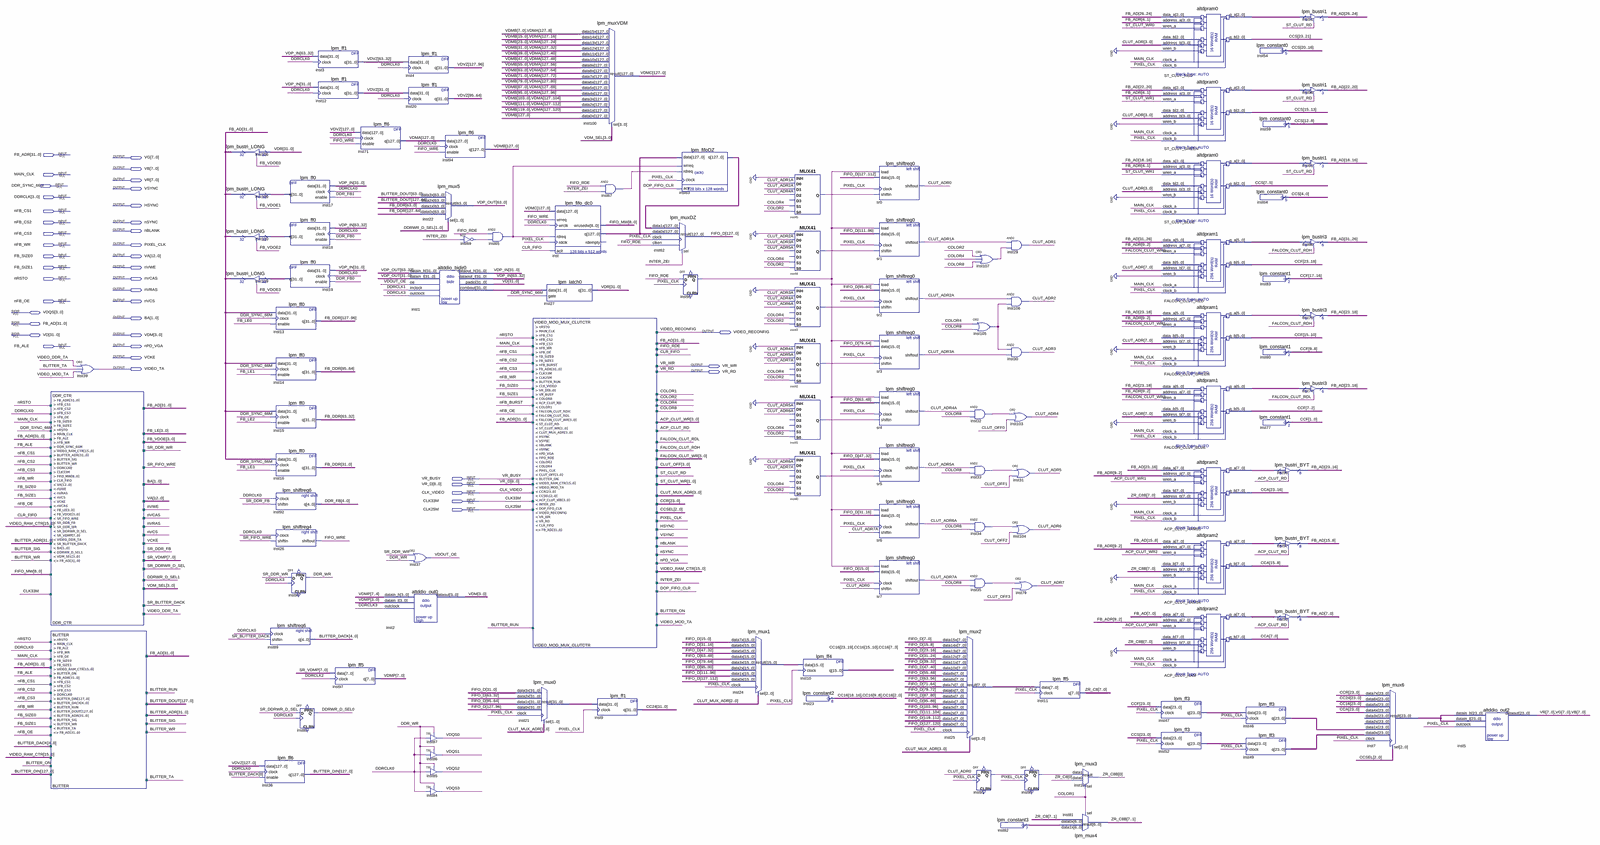
[diagram p0: schematic sheet, whole]
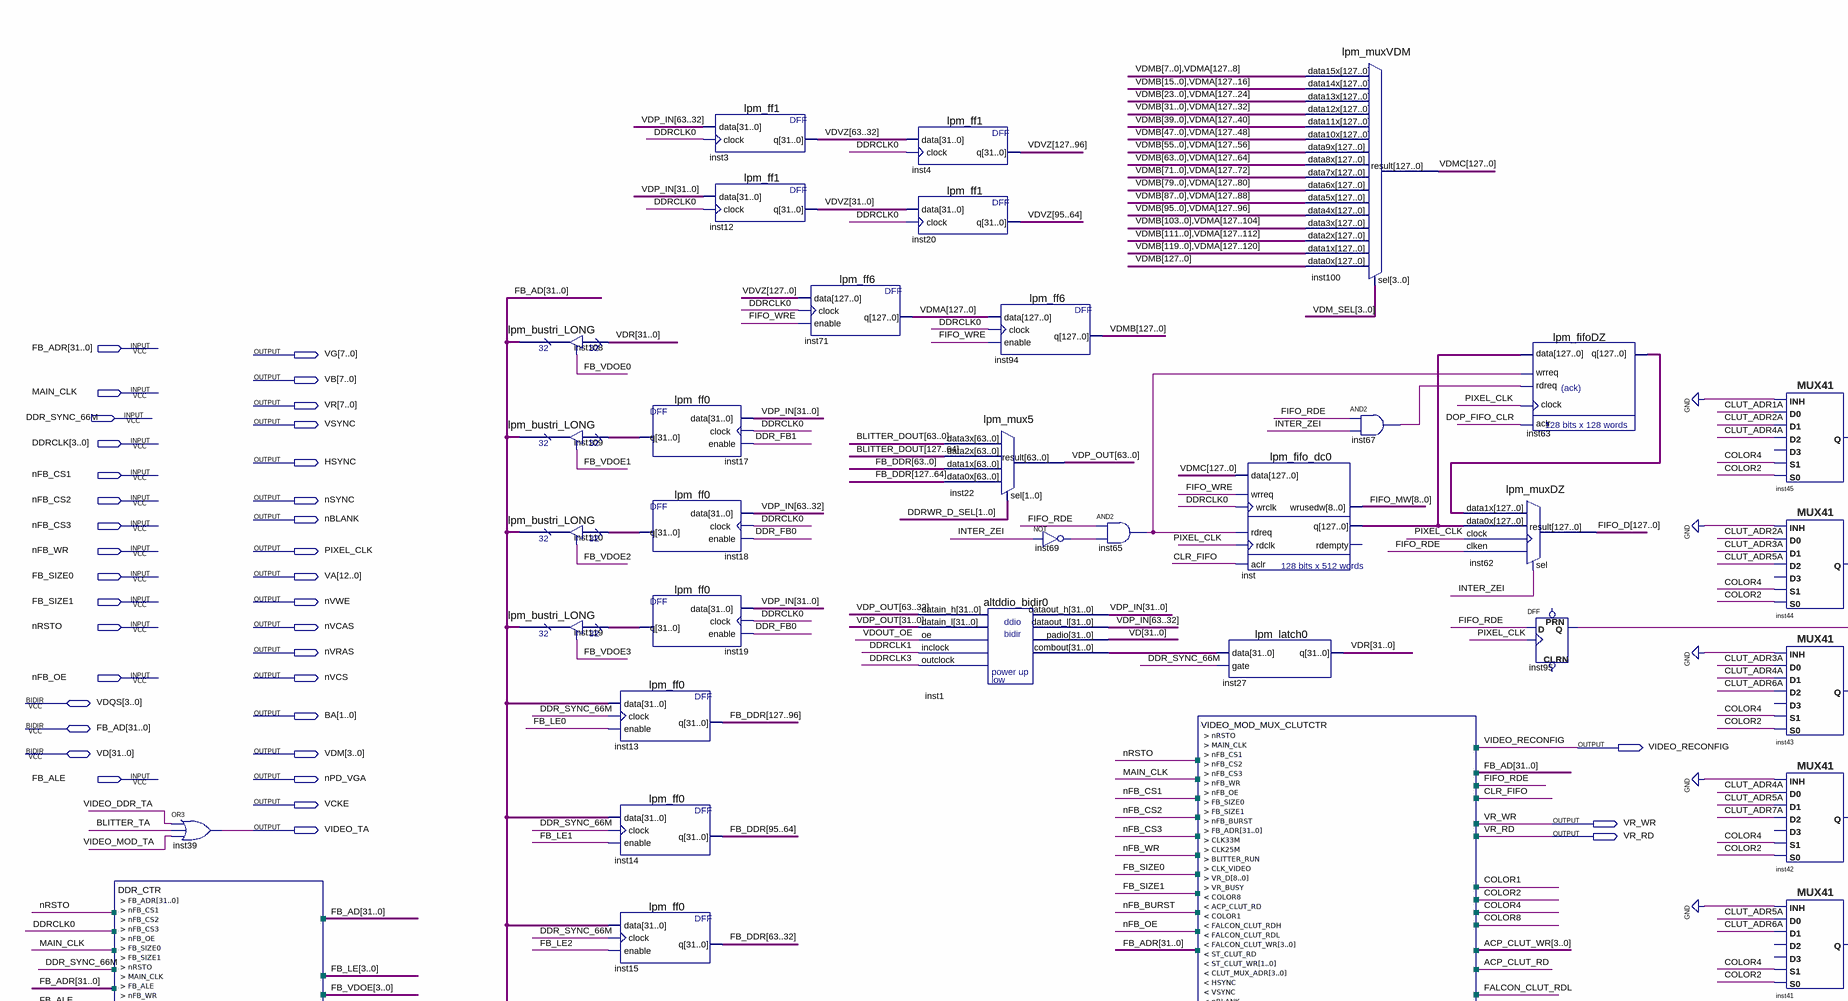
[diagram p1: schematic sheet, upper left part]
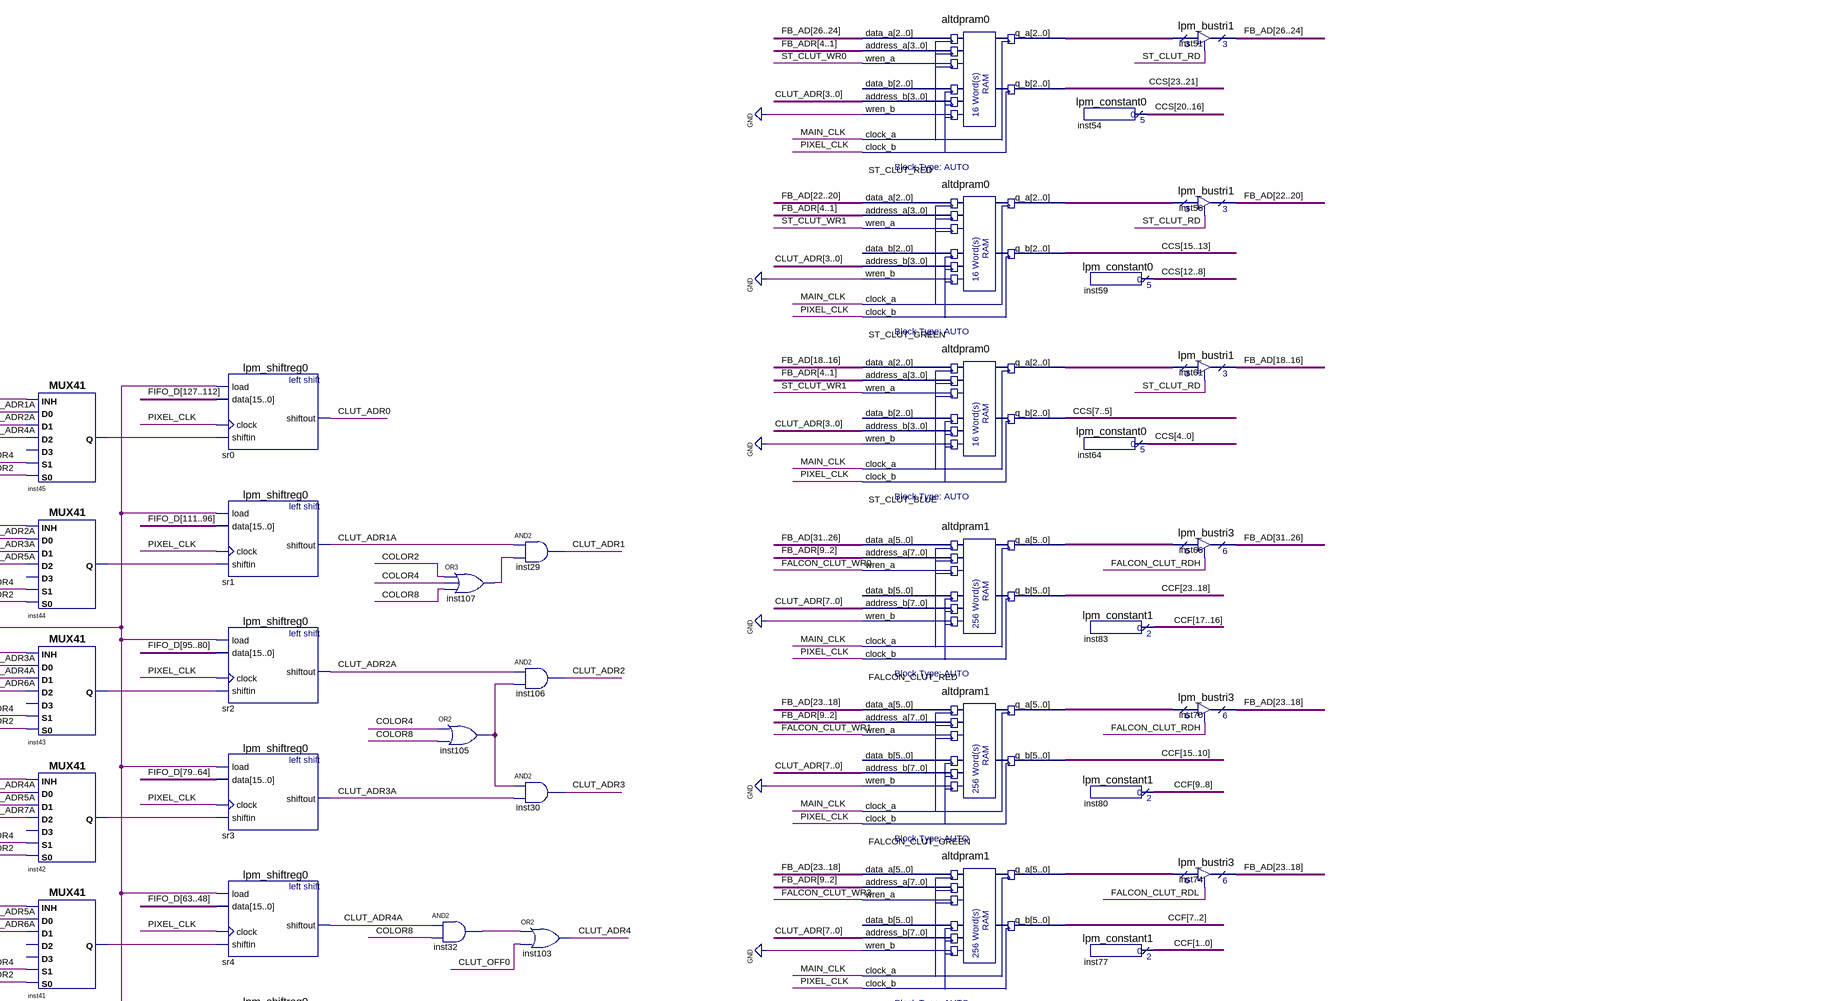
[diagram p2: schematic sheet, upper right part]
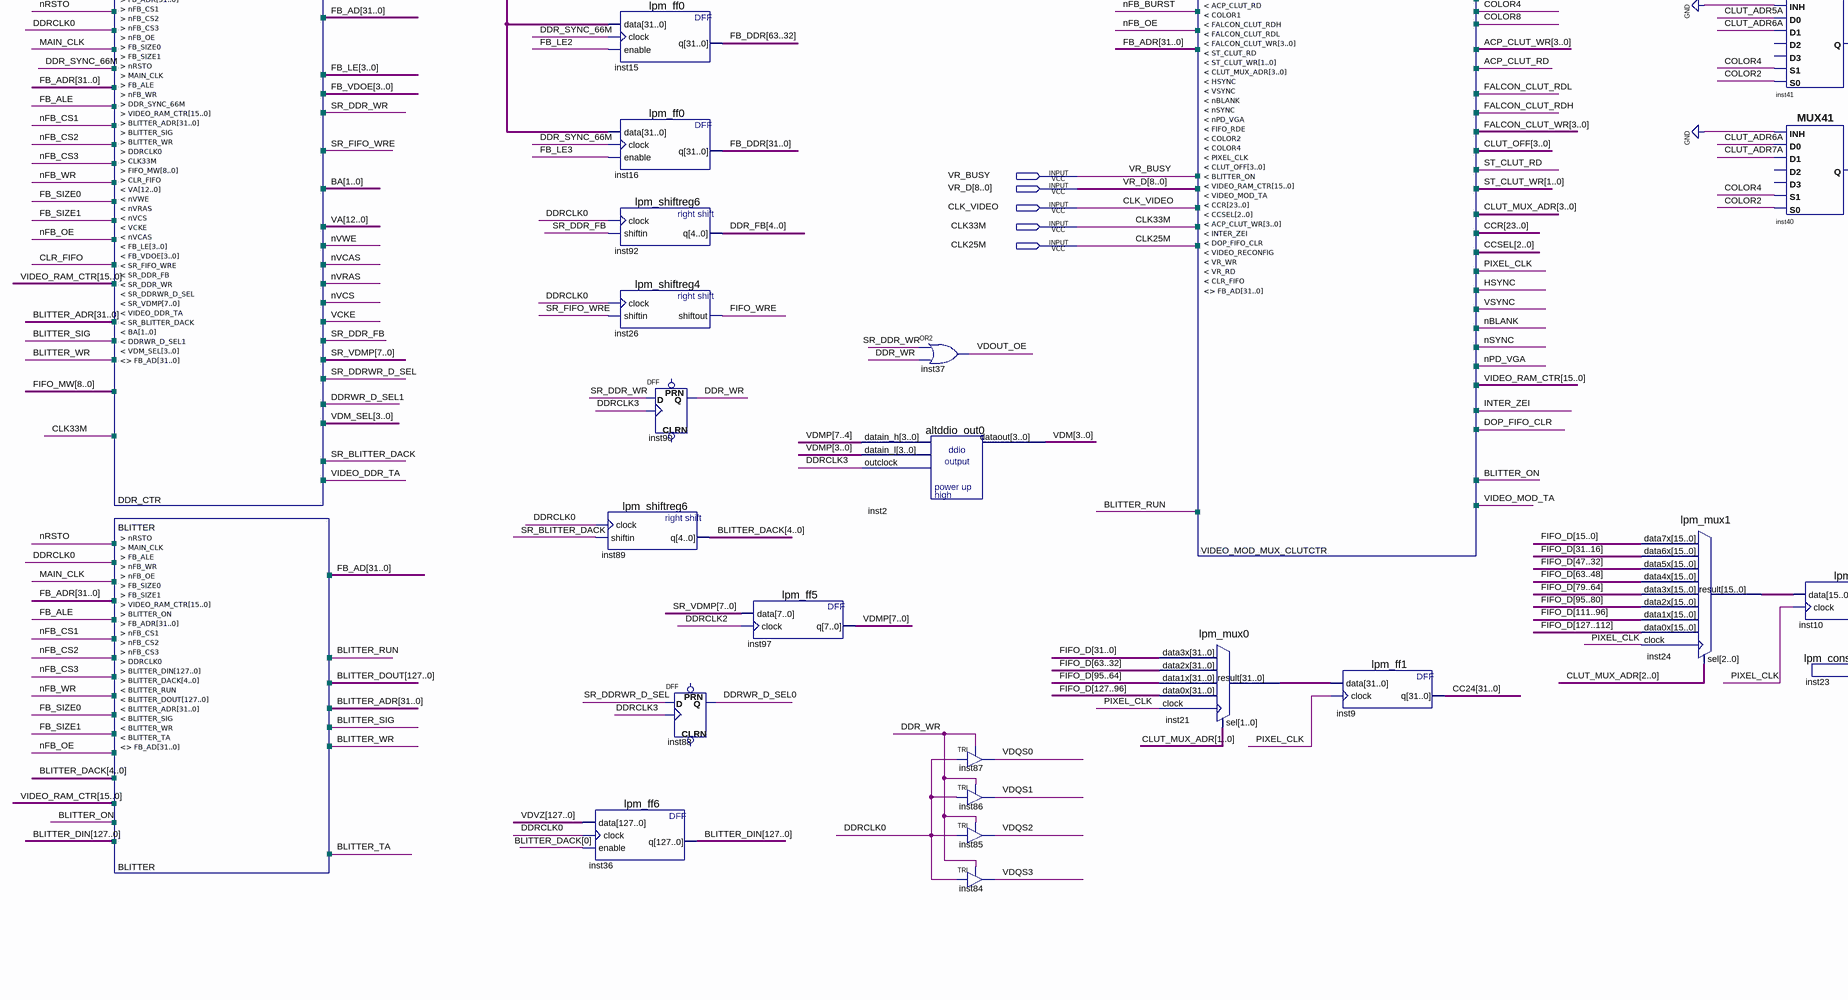
[diagram p3: schematic sheet, lower left part]
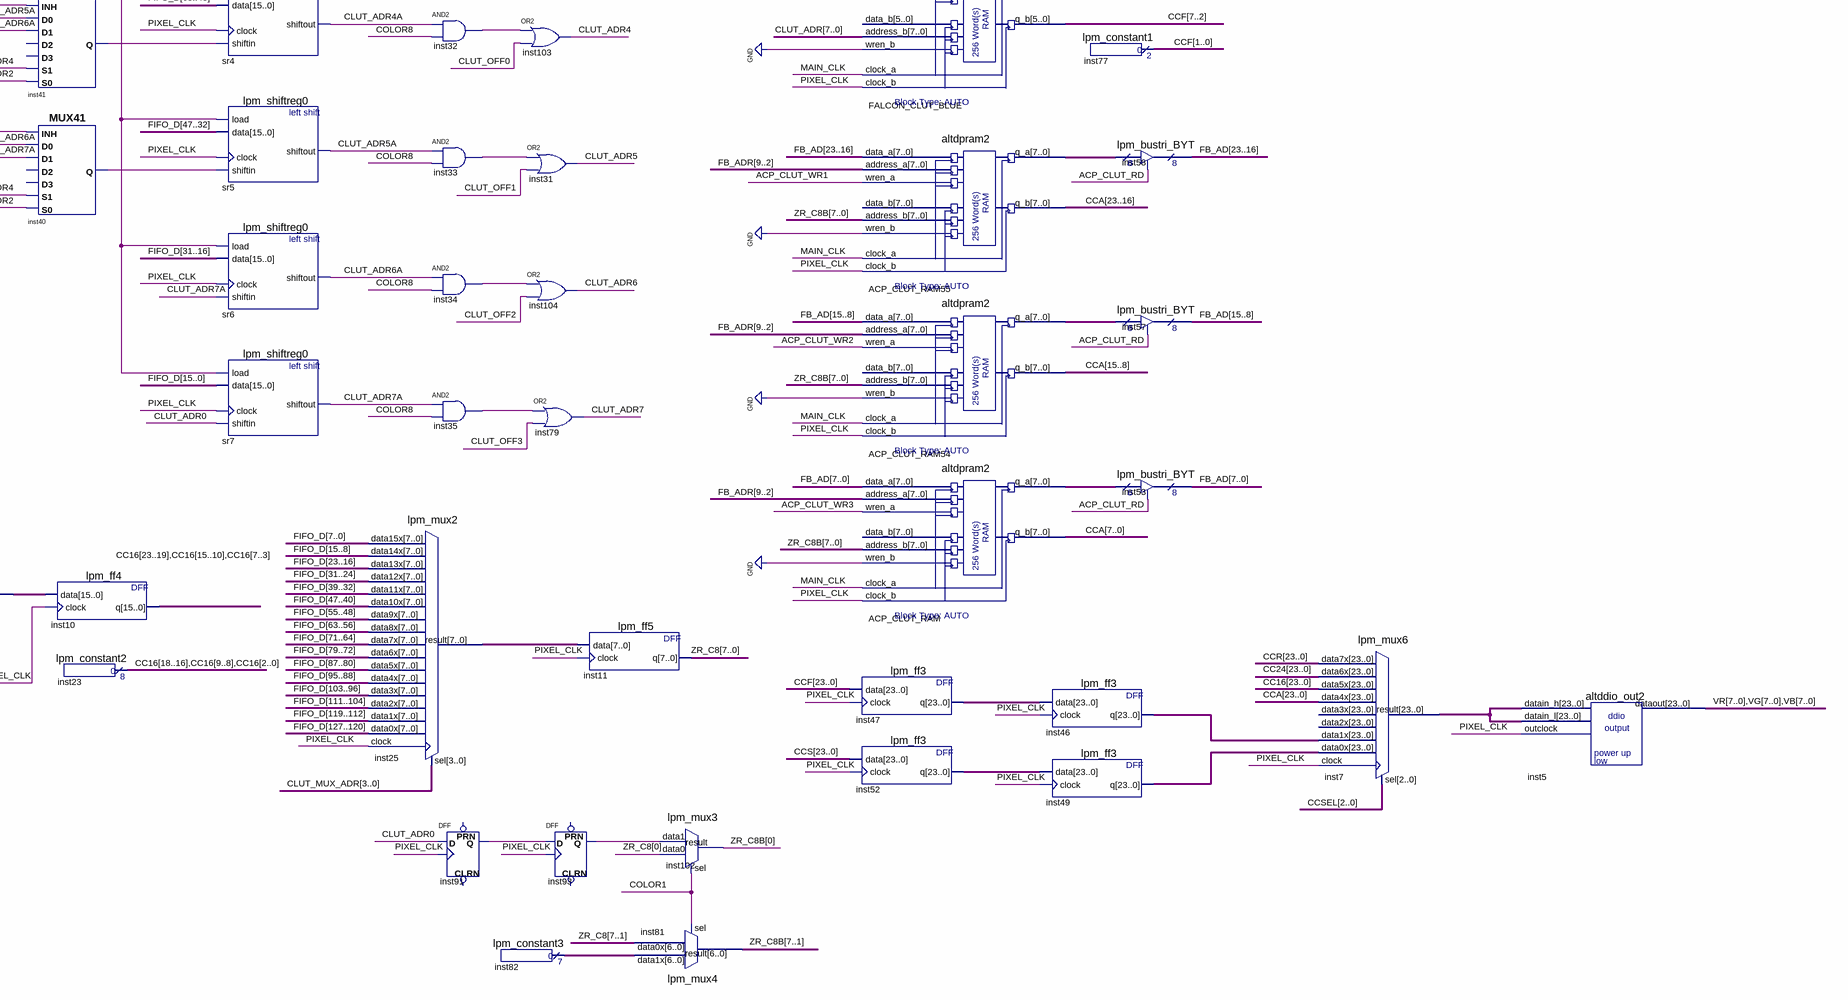
[diagram p4: schematic sheet, lower right part]
// Quartus schematic Video.bdf as structural Verilog: 114 symbols, 42 pins
module Video (
  input  [31:0] FB_ADR,
  input  MAIN_CLK,
  input  DDR_SYNC_66M,
  input  [3:0] DDRCLK,
  input  nFB_CS1,
  input  nFB_CS2,
  input  nFB_CS3,
  input  nFB_WR,
  input  FB_SIZE0,
  input  FB_SIZE1,
  input  nRSTO,
  input  nFB_OE,
  input  FB_ALE,
  input  VR_BUSY,
  input  [8:0] VR_D,
  input  CLK_VIDEO,
  input  CLK33M,
  input  CLK25M,
  inout  [3:0] VDQS,
  inout  [31:0] FB_AD,
  inout  [31:0] VD,
  output [7:0] VG,
  output [7:0] VB,
  output [7:0] VR,
  output VSYNC,
  output HSYNC,
  output nSYNC,
  output nBLANK,
  output PIXEL_CLK,
  output [12:0] VA,
  output nVWE,
  output nVCAS,
  output nVRAS,
  output nVCS,
  output [1:0] BA,
  output VIDEO_RECONFIG,
  output [3:0] VDM,
  output nPD_VGA,
  output VCKE,
  output VR_WR,
  output VIDEO_TA,
  output VR_RD
);

  wire ACP_CLUT_RD, BLITTER_ON, BLITTER_RUN, BLITTER_SIG, BLITTER_TA, BLITTER_WR, CLR_FIFO, CLUT_ADR1A,
       CLUT_ADR2A, CLUT_ADR3A, CLUT_ADR4A, CLUT_ADR5A, CLUT_ADR6A, CLUT_ADR7A, COLOR1, COLOR2, COLOR4,
       COLOR8, DDR_WR, DOP_FIFO_CLR, FALCON_CLUT_RDH, FALCON_CLUT_RDL, FIFO_RDE, FIFO_WRE, inst32_out,
       inst33_out, inst34_out, inst35_out, inst40_q, inst41_q, inst42_q, inst43_q, inst44_q, inst45_q,
       inst65_out, inst67_out, inst69_out, inst91_q, inst93_q, inst95_q, inst105_out, inst107_out, INTER_ZEI,
       nFB_BURST, SR_BLITTER_DACK, SR_DDR_FB, SR_DDR_WR, SR_DDRWR_D_SEL, SR_FIFO_WRE, ST_CLUT_RD, VDOUT_OE,
       VIDEO_DDR_TA, VIDEO_MOD_TA;
  wire [1:0] DDRWR_D_SEL, ST_CLUT_WR;
  wire [2:0] CCSEL, ST_CLUT_BLUE_q_a, ST_CLUT_GREEN_q_a, ST_CLUT_RED_q_a;
  wire [3:0] ACP_CLUT_WR, CLUT_MUX_ADR, CLUT_OFF, FALCON_CLUT_WR, FB_LE, FB_VDOE, VDM_SEL;
  wire [4:0] BLITTER_DACK, DDR_FB;
  wire [5:0] FALCON_CLUT_BLUE_q_a, FALCON_CLUT_GREEN_q_a, FALCON_CLUT_RED_q_a;
  wire [6:0] inst82_result;
  wire [7:0] ACP_CLUT_RAM54_q_a, ACP_CLUT_RAM55_q_a, ACP_CLUT_RAM_q_a, CLUT_ADR, inst25_result, SR_VDMP,
       VDMP, ZR_C8, ZR_C8B;
  wire [8:0] FIFO_MW;
  wire [15:0] inst24_result, VIDEO_RAM_CTR;
  wire [23:0] CC16, CCA, CCF, CCR, CCS, inst7_result, inst46_q, inst47_q, inst49_q, inst52_q;
  wire [31:0] BLITTER_ADR, CC24, inst1_combout, inst17_q, inst18_q, inst19_q, inst21_result, VDR;
  wire [63:0] VDP_IN, VDP_OUT;
  wire [127:0] BLITTER_DIN, BLITTER_DOUT, FB_DDR, FIFO_D, inst63_q, inst_q, VDMA, VDMB, VDMC, VDVZ;

  DDR_CTR DDR_CTR (
    .FB_ADR(FB_ADR), .nFB_CS1(nFB_CS1), .nFB_CS2(nFB_CS2), .nFB_CS3(nFB_CS3), .nFB_OE(nFB_OE),
    .FB_SIZE0(FB_SIZE0), .FB_SIZE1(FB_SIZE1), .nRSTO(nRSTO), .MAIN_CLK(MAIN_CLK), .FB_ALE(FB_ALE),
    .nFB_WR(nFB_WR), .DDR_SYNC_66M(DDR_SYNC_66M), .VIDEO_RAM_CTR(VIDEO_RAM_CTR), .BLITTER_ADR(BLITTER_ADR),
    .BLITTER_SIG(BLITTER_SIG), .BLITTER_WR(BLITTER_WR), .DDRCLK0(DDRCLK[0]), .CLK33M(CLK33M),
    .FIFO_MW(FIFO_MW), .CLR_FIFO(CLR_FIFO), .VA(VA), .nVWE(nVWE), .nVRAS(nVRAS), .nVCS(nVCS), .VCKE(VCKE),
    .nVCAS(nVCAS), .FB_LE(FB_LE), .FB_VDOE(FB_VDOE), .SR_FIFO_WRE(SR_FIFO_WRE), .SR_DDR_FB(SR_DDR_FB),
    .SR_DDR_WR(SR_DDR_WR), .SR_DDRWR_D_SEL(SR_DDRWR_D_SEL), .SR_VDMP(SR_VDMP), .VIDEO_DDR_TA(VIDEO_DDR_TA),
    .SR_BLITTER_DACK(SR_BLITTER_DACK), .BA(BA), .DDRWR_D_SEL1(DDRWR_D_SEL[1]), .VDM_SEL(VDM_SEL),
    .FB_AD(FB_AD));
  BLITTER BLITTER (
    .nRSTO(nRSTO), .MAIN_CLK(MAIN_CLK), .FB_ALE(FB_ALE), .nFB_WR(nFB_WR), .nFB_OE(nFB_OE),
    .FB_SIZE0(FB_SIZE0), .FB_SIZE1(FB_SIZE1), .VIDEO_RAM_CTR(VIDEO_RAM_CTR), .BLITTER_ON(BLITTER_ON),
    .FB_ADR(FB_ADR), .nFB_CS1(nFB_CS1), .nFB_CS2(nFB_CS2), .nFB_CS3(nFB_CS3), .DDRCLK0(DDRCLK[0]),
    .BLITTER_DIN(BLITTER_DIN), .BLITTER_DACK(BLITTER_DACK), .BLITTER_RUN(BLITTER_RUN),
    .BLITTER_DOUT(BLITTER_DOUT), .BLITTER_ADR(BLITTER_ADR), .BLITTER_SIG(BLITTER_SIG),
    .BLITTER_WR(BLITTER_WR), .BLITTER_TA(BLITTER_TA), .FB_AD(FB_AD));
  or inst39 (VIDEO_TA, VIDEO_DDR_TA, BLITTER_TA, VIDEO_MOD_TA);
  lpm_bustri_LONG inst108 (.enabledt(FB_VDOE[0]), .data(VDR), .tridata(FB_AD));
  lpm_bustri_LONG inst109 (.enabledt(FB_VDOE[1]), .data(inst17_q), .tridata(FB_AD));
  lpm_bustri_LONG inst110 (.enabledt(FB_VDOE[2]), .data(inst18_q), .tridata(FB_AD));
  lpm_bustri_LONG inst119 (.enabledt(FB_VDOE[3]), .data(inst19_q), .tridata(FB_AD));
  lpm_ff6 inst36 (.data(VDVZ), .clock(DDRCLK[0]), .enable(BLITTER_DACK[0]), .q(BLITTER_DIN));
  lpm_ff0 inst13 (.data(FB_AD), .clock(DDR_SYNC_66M), .enable(FB_LE[0]), .q(FB_DDR[127:96]));
  lpm_ff0 inst14 (.data(FB_AD), .clock(DDR_SYNC_66M), .enable(FB_LE[1]), .q(FB_DDR[95:64]));
  lpm_ff0 inst15 (.data(FB_AD), .clock(DDR_SYNC_66M), .enable(FB_LE[2]), .q(FB_DDR[63:32]));
  lpm_ff0 inst16 (.data(FB_AD), .clock(DDR_SYNC_66M), .enable(FB_LE[3]), .q(FB_DDR[31:0]));
  lpm_shiftreg6 inst92 (.clock(DDRCLK[0]), .shiftin(SR_DDR_FB), .q(DDR_FB));
  lpm_shiftreg4 inst26 (.clock(DDRCLK[0]), .shiftin(SR_FIFO_WRE), .shiftout(FIFO_WRE));
  lpm_shiftreg6 inst89 (.clock(DDRCLK[0]), .shiftin(SR_BLITTER_DACK), .q(BLITTER_DACK));
  lpm_ff0 inst17 (.data(VDP_IN[31:0]), .clock(DDRCLK[0]), .enable(DDR_FB[1]), .q(inst17_q));
  lpm_ff0 inst18 (.data(VDP_IN[63:32]), .clock(DDRCLK[0]), .enable(DDR_FB[0]), .q(inst18_q));
  lpm_ff0 inst19 (.data(VDP_IN[31:0]), .clock(DDRCLK[0]), .enable(DDR_FB[0]), .q(inst19_q));
  DFF inst90 (.CLK(DDRCLK[3]), .D(SR_DDR_WR), .Q(DDR_WR));  // open: CLRN, PRN
  DFF inst88 (.CLK(DDRCLK[3]), .D(SR_DDRWR_D_SEL), .Q(DDRWR_D_SEL[0]));  // open: CLRN, PRN
  lpm_ff1 inst3 (.data(VDP_IN[63:32]), .clock(DDRCLK[0]), .q(VDVZ[63:32]));
  lpm_ff1 inst12 (.data(VDP_IN[31:0]), .clock(DDRCLK[0]), .q(VDVZ[31:0]));
  lpm_ff5 inst97 (.data(SR_VDMP), .clock(DDRCLK[2]), .q(VDMP));
  lpm_ff6 inst71 (.data(VDVZ), .clock(DDRCLK[0]), .enable(FIFO_WRE), .q(VDMA));
  altddio_out0 inst2 (.datain_h(VDMP[7:4]), .datain_l(VDMP[3:0]), .outclock(DDRCLK[3]), .dataout(VDM));
  lpm_ff1 inst4 (.data(VDVZ[63:32]), .clock(DDRCLK[0]), .q(VDVZ[127:96]));
  lpm_ff1 inst20 (.data(VDVZ[31:0]), .clock(DDRCLK[0]), .q(VDVZ[95:64]));
  altddio_bidir0 inst1 (
    .datain_h(VDP_OUT[63:32]), .datain_l(VDP_OUT[31:0]), .oe(VDOUT_OE), .inclock(DDRCLK[1]),
    .outclock(DDRCLK[3]), .dataout_h(VDP_IN[31:0]), .dataout_l(VDP_IN[63:32]), .combout(inst1_combout),
    .padio(VD));
  or inst37 (VDOUT_OE, SR_DDR_WR, DDR_WR);
  lpm_ff6 inst94 (.data(VDMA), .clock(DDRCLK[0]), .enable(FIFO_WRE), .q(VDMB));
  lpm_mux5 inst22 (
    .data3x(BLITTER_DOUT[63:0]), .data2x(BLITTER_DOUT[127:64]), .data1x(FB_DDR[63:0]),
    .data0x(FB_DDR[127:64]), .sel(DDRWR_D_SEL), .result(VDP_OUT));
  TRI inst87 (.IN(DDRCLK[0]), .OE(DDR_WR), .OUT(VDQS[0]));
  TRI inst86 (.IN(DDRCLK[0]), .OE(DDR_WR), .OUT(VDQS[1]));
  TRI inst85 (.IN(DDRCLK[0]), .OE(DDR_WR), .OUT(VDQS[2]));
  TRI inst84 (.IN(DDRCLK[0]), .OE(DDR_WR), .OUT(VDQS[3]));
  not inst69 (inst69_out, INTER_ZEI);
  and inst65 (inst65_out, FIFO_RDE, inst69_out);
  lpm_mux0 inst21 (
    .data3x(FIFO_D[31:0]), .data2x(FIFO_D[63:32]), .data1x(FIFO_D[95:64]), .data0x(FIFO_D[127:96]),
    .clock(PIXEL_CLK), .sel(CLUT_MUX_ADR[1:0]), .result(inst21_result));
  lpm_fifo_dc0 inst (
    .data(VDMC), .wrreq(FIFO_WRE), .wrclk(DDRCLK[0]), .rdreq(inst65_out), .rdclk(PIXEL_CLK), .aclr(CLR_FIFO),
    .wrusedw(FIFO_MW), .q(inst_q));  // open: rdempty
  lpm_latch0 inst27 (.data(inst1_combout), .gate(DDR_SYNC_66M), .q(VDR));
  VIDEO_MOD_MUX_CLUTCTR VIDEO_MOD_MUX_CLUTCTR (
    .nRSTO(nRSTO), .MAIN_CLK(MAIN_CLK), .nFB_CS1(nFB_CS1), .nFB_CS2(nFB_CS2), .nFB_CS3(nFB_CS3),
    .nFB_WR(nFB_WR), .nFB_OE(nFB_OE), .FB_SIZE0(FB_SIZE0), .FB_SIZE1(FB_SIZE1), .nFB_BURST(nFB_BURST),
    .FB_ADR(FB_ADR), .CLK33M(CLK33M), .CLK25M(CLK25M), .BLITTER_RUN(BLITTER_RUN), .CLK_VIDEO(CLK_VIDEO),
    .VR_D(VR_D), .VR_BUSY(VR_BUSY), .COLOR8(COLOR8), .ACP_CLUT_RD(ACP_CLUT_RD), .COLOR1(COLOR1),
    .FALCON_CLUT_RDH(FALCON_CLUT_RDH), .FALCON_CLUT_RDL(FALCON_CLUT_RDL), .FALCON_CLUT_WR(FALCON_CLUT_WR),
    .ST_CLUT_RD(ST_CLUT_RD), .ST_CLUT_WR(ST_CLUT_WR), .CLUT_MUX_ADR(CLUT_MUX_ADR), .HSYNC(HSYNC),
    .VSYNC(VSYNC), .nBLANK(nBLANK), .nSYNC(nSYNC), .nPD_VGA(nPD_VGA), .FIFO_RDE(FIFO_RDE), .COLOR2(COLOR2),
    .COLOR4(COLOR4), .PIXEL_CLK(PIXEL_CLK), .CLUT_OFF(CLUT_OFF), .BLITTER_ON(BLITTER_ON),
    .VIDEO_RAM_CTR(VIDEO_RAM_CTR), .VIDEO_MOD_TA(VIDEO_MOD_TA), .CCR(CCR), .CCSEL(CCSEL),
    .ACP_CLUT_WR(ACP_CLUT_WR), .INTER_ZEI(INTER_ZEI), .DOP_FIFO_CLR(DOP_FIFO_CLR),
    .VIDEO_RECONFIG(VIDEO_RECONFIG), .VR_WR(VR_WR), .VR_RD(VR_RD), .CLR_FIFO(CLR_FIFO), .FB_AD(FB_AD));
  lpm_muxVDM inst100 (
    .data15x({VDMB[7:0], VDMA[127:8]}), .data14x({VDMB[15:0], VDMA[127:16]}),
    .data13x({VDMB[23:0], VDMA[127:24]}), .data12x({VDMB[31:0], VDMA[127:32]}),
    .data11x({VDMB[39:0], VDMA[127:40]}), .data10x({VDMB[47:0], VDMA[127:48]}),
    .data9x({VDMB[55:0], VDMA[127:56]}), .data8x({VDMB[63:0], VDMA[127:64]}),
    .data7x({VDMB[71:0], VDMA[127:72]}), .data6x({VDMB[79:0], VDMA[127:80]}),
    .data5x({VDMB[87:0], VDMA[127:88]}), .data4x({VDMB[95:0], VDMA[127:96]}),
    .data3x({VDMB[103:0], VDMA[127:104]}), .data2x({VDMB[111:0], VDMA[127:112]}),
    .data1x({VDMB[119:0], VDMA[127:120]}), .data0x(VDMB), .sel(VDM_SEL), .result(VDMC));
  lpm_ff1 inst9 (.data(inst21_result), .clock(PIXEL_CLK), .q(CC24));
  and inst67 (inst67_out, FIFO_RDE, INTER_ZEI);
  lpm_muxDZ inst62 (
    .data1x(inst63_q), .data0x(inst_q), .clock(PIXEL_CLK), .clken(FIFO_RDE), .sel(INTER_ZEI), .result(FIFO_D));
  lpm_fifoDZ inst63 (
    .data(inst_q), .wrreq(inst65_out), .rdreq(inst67_out), .clock(PIXEL_CLK), .aclr(DOP_FIFO_CLR),
    .q(inst63_q));
  DFF inst95 (.CLK(PIXEL_CLK), .D(FIFO_RDE), .Q(inst95_q));  // open: CLRN, PRN
  lpm_mux1 inst24 (
    .data7x(FIFO_D[15:0]), .data6x(FIFO_D[31:16]), .data5x(FIFO_D[47:32]), .data4x(FIFO_D[63:48]),
    .data3x(FIFO_D[79:64]), .data2x(FIFO_D[95:80]), .data1x(FIFO_D[111:96]), .data0x(FIFO_D[127:112]),
    .clock(PIXEL_CLK), .sel(CLUT_MUX_ADR[2:0]), .result(inst24_result));
  MUX41 inst45 (
    .S0(COLOR2), .D2(CLUT_ADR4A), .S1(COLOR4), .D0(CLUT_ADR1A), .INH(1'b0), .D1(CLUT_ADR2A), .Q(inst45_q));  // open: D3
  MUX41 inst44 (
    .S0(COLOR2), .D2(CLUT_ADR5A), .S1(COLOR4), .D0(CLUT_ADR2A), .INH(1'b0), .D1(CLUT_ADR3A), .Q(inst44_q));  // open: D3
  MUX41 inst43 (
    .S0(COLOR2), .D2(CLUT_ADR6A), .S1(COLOR4), .D0(CLUT_ADR3A), .INH(1'b0), .D1(CLUT_ADR4A), .Q(inst43_q));  // open: D3
  MUX41 inst42 (
    .S0(COLOR2), .D2(CLUT_ADR7A), .S1(COLOR4), .D0(CLUT_ADR4A), .INH(1'b0), .D1(CLUT_ADR5A), .Q(inst42_q));  // open: D3
  MUX41 inst41 (.S0(COLOR2), .S1(COLOR4), .D0(CLUT_ADR5A), .INH(1'b0), .D1(CLUT_ADR6A), .Q(inst41_q));  // open: D2, D3
  MUX41 inst40 (.S0(COLOR2), .S1(COLOR4), .D0(CLUT_ADR6A), .INH(1'b0), .D1(CLUT_ADR7A), .Q(inst40_q));  // open: D2, D3
  lpm_ff4 inst10 (.data(inst24_result), .clock(PIXEL_CLK), .q({CC16[23:19], CC16[15:10], CC16[7:3]}));
  lpm_constant2 inst23 (.result({CC16[18:16], CC16[9:8], CC16[2:0]}));
  lpm_shiftreg0 sr0 (
    .load(inst95_q), .data(FIFO_D[127:112]), .clock(PIXEL_CLK), .shiftin(inst45_q), .shiftout(CLUT_ADR[0]));
  lpm_shiftreg0 sr1 (
    .load(inst95_q), .data(FIFO_D[111:96]), .clock(PIXEL_CLK), .shiftin(inst44_q), .shiftout(CLUT_ADR1A));
  lpm_shiftreg0 sr2 (
    .load(inst95_q), .data(FIFO_D[95:80]), .clock(PIXEL_CLK), .shiftin(inst43_q), .shiftout(CLUT_ADR2A));
  lpm_shiftreg0 sr3 (
    .load(inst95_q), .data(FIFO_D[79:64]), .clock(PIXEL_CLK), .shiftin(inst42_q), .shiftout(CLUT_ADR3A));
  lpm_shiftreg0 sr4 (
    .load(inst95_q), .data(FIFO_D[63:48]), .clock(PIXEL_CLK), .shiftin(inst41_q), .shiftout(CLUT_ADR4A));
  lpm_shiftreg0 sr5 (
    .load(inst95_q), .data(FIFO_D[47:32]), .clock(PIXEL_CLK), .shiftin(inst40_q), .shiftout(CLUT_ADR5A));
  lpm_shiftreg0 sr6 (
    .load(inst95_q), .data(FIFO_D[31:16]), .clock(PIXEL_CLK), .shiftin(CLUT_ADR7A), .shiftout(CLUT_ADR6A));
  lpm_shiftreg0 sr7 (
    .load(inst95_q), .data(FIFO_D[15:0]), .clock(PIXEL_CLK), .shiftin(CLUT_ADR[0]), .shiftout(CLUT_ADR7A));
  lpm_mux2 inst25 (
    .data15x(FIFO_D[7:0]), .data14x(FIFO_D[15:8]), .data13x(FIFO_D[23:16]), .data12x(FIFO_D[31:24]),
    .data11x(FIFO_D[39:32]), .data10x(FIFO_D[47:40]), .data9x(FIFO_D[55:48]), .data8x(FIFO_D[63:56]),
    .data7x(FIFO_D[71:64]), .data6x(FIFO_D[79:72]), .data5x(FIFO_D[87:80]), .data4x(FIFO_D[95:88]),
    .data3x(FIFO_D[103:96]), .data2x(FIFO_D[111:104]), .data1x(FIFO_D[119:112]), .data0x(FIFO_D[127:120]),
    .clock(PIXEL_CLK), .sel(CLUT_MUX_ADR), .result(inst25_result));
  or inst107 (inst107_out, COLOR2, COLOR4, COLOR8);
  or inst105 (inst105_out, COLOR4, COLOR8);
  and inst32 (inst32_out, CLUT_ADR4A, COLOR8);
  and inst33 (inst33_out, CLUT_ADR5A, COLOR8);
  and inst34 (inst34_out, CLUT_ADR6A, COLOR8);
  and inst35 (inst35_out, CLUT_ADR7A, COLOR8);
  DFF inst91 (.CLK(PIXEL_CLK), .D(CLUT_ADR[0]), .Q(inst91_q));  // open: CLRN, PRN
  lpm_constant3 inst82 (.result(inst82_result));
  and inst29 (CLUT_ADR[1], CLUT_ADR1A, inst107_out);
  and inst106 (CLUT_ADR[2], CLUT_ADR2A, inst105_out);
  and inst30 (CLUT_ADR[3], inst105_out, CLUT_ADR3A);
  or inst103 (CLUT_ADR[4], inst32_out, CLUT_OFF[0]);
  or inst31 (CLUT_ADR[5], inst33_out, CLUT_OFF[1]);
  or inst104 (CLUT_ADR[6], inst34_out, CLUT_OFF[2]);
  or inst79 (CLUT_ADR[7], inst35_out, CLUT_OFF[3]);
  DFF inst93 (.CLK(PIXEL_CLK), .D(inst91_q), .Q(inst93_q));  // open: CLRN, PRN
  lpm_ff5 inst11 (.data(inst25_result), .clock(PIXEL_CLK), .q(ZR_C8));
  lpm_mux3 inst102 (.data1(inst93_q), .data0(ZR_C8[0]), .sel(COLOR1), .result(ZR_C8B[0]));
  lpm_mux4 inst81 (.data1x(inst82_result), .data0x(ZR_C8[7:1]), .sel(COLOR1), .result(ZR_C8B[7:1]));
  altdpram0 ST_CLUT_RED (
    .data_a(FB_AD[26:24]), .address_a(FB_ADR[4:1]), .wren_a(ST_CLUT_WR[0]), .address_b(CLUT_ADR[3:0]),
    .wren_b(1'b0), .clock_a(MAIN_CLK), .clock_b(PIXEL_CLK), .q_a(ST_CLUT_RED_q_a), .q_b(CCS[23:21]));  // open: data_b
  altdpram0 ST_CLUT_GREEN (
    .data_a(FB_AD[22:20]), .address_a(FB_ADR[4:1]), .wren_a(ST_CLUT_WR[1]), .address_b(CLUT_ADR[3:0]),
    .wren_b(1'b0), .clock_a(MAIN_CLK), .clock_b(PIXEL_CLK), .q_a(ST_CLUT_GREEN_q_a), .q_b(CCS[15:13]));  // open: data_b
  altdpram0 ST_CLUT_BLUE (
    .data_a(FB_AD[18:16]), .address_a(FB_ADR[4:1]), .wren_a(ST_CLUT_WR[1]), .address_b(CLUT_ADR[3:0]),
    .wren_b(1'b0), .clock_a(MAIN_CLK), .clock_b(PIXEL_CLK), .q_a(ST_CLUT_BLUE_q_a), .q_b(CCS[7:5]));  // open: data_b
  altdpram1 FALCON_CLUT_RED (
    .data_a(FB_AD[31:26]), .address_a(FB_ADR[9:2]), .wren_a(FALCON_CLUT_WR[0]), .address_b(CLUT_ADR),
    .wren_b(1'b0), .clock_a(MAIN_CLK), .clock_b(PIXEL_CLK), .q_a(FALCON_CLUT_RED_q_a), .q_b(CCF[23:18]));  // open: data_b
  altdpram1 FALCON_CLUT_GREEN (
    .data_a(FB_AD[23:18]), .address_a(FB_ADR[9:2]), .wren_a(FALCON_CLUT_WR[1]), .address_b(CLUT_ADR),
    .wren_b(1'b0), .clock_a(MAIN_CLK), .clock_b(PIXEL_CLK), .q_a(FALCON_CLUT_GREEN_q_a), .q_b(CCF[15:10]));  // open: data_b
  altdpram1 FALCON_CLUT_BLUE (
    .data_a(FB_AD[23:18]), .address_a(FB_ADR[9:2]), .wren_a(FALCON_CLUT_WR[3]), .address_b(CLUT_ADR),
    .wren_b(1'b0), .clock_a(MAIN_CLK), .clock_b(PIXEL_CLK), .q_a(FALCON_CLUT_BLUE_q_a), .q_b(CCF[7:2]));  // open: data_b
  altdpram2 ACP_CLUT_RAM55 (
    .data_a(FB_AD[23:16]), .address_a(FB_ADR[9:2]), .wren_a(ACP_CLUT_WR[1]), .address_b(ZR_C8B),
    .wren_b(1'b0), .clock_a(MAIN_CLK), .clock_b(PIXEL_CLK), .q_a(ACP_CLUT_RAM55_q_a), .q_b(CCA[23:16]));  // open: data_b
  altdpram2 ACP_CLUT_RAM54 (
    .data_a(FB_AD[15:8]), .address_a(FB_ADR[9:2]), .wren_a(ACP_CLUT_WR[2]), .address_b(ZR_C8B),
    .wren_b(1'b0), .clock_a(MAIN_CLK), .clock_b(PIXEL_CLK), .q_a(ACP_CLUT_RAM54_q_a), .q_b(CCA[15:8]));  // open: data_b
  altdpram2 ACP_CLUT_RAM (
    .data_a(FB_AD[7:0]), .address_a(FB_ADR[9:2]), .wren_a(ACP_CLUT_WR[3]), .address_b(ZR_C8B), .wren_b(1'b0),
    .clock_a(MAIN_CLK), .clock_b(PIXEL_CLK), .q_a(ACP_CLUT_RAM_q_a), .q_b(CCA[7:0]));  // open: data_b
  lpm_ff3 inst47 (.data(CCF), .clock(PIXEL_CLK), .q(inst47_q));
  lpm_ff3 inst52 (.data(CCS), .clock(PIXEL_CLK), .q(inst52_q));
  lpm_ff3 inst46 (.data(inst47_q), .clock(PIXEL_CLK), .q(inst46_q));
  lpm_ff3 inst49 (.data(inst52_q), .clock(PIXEL_CLK), .q(inst49_q));
  lpm_constant0 inst54 (.result(CCS[20:16]));
  lpm_constant0 inst59 (.result(CCS[12:8]));
  lpm_constant0 inst64 (.result(CCS[4:0]));
  lpm_constant1 inst83 (.result(CCF[17:16]));
  lpm_constant1 inst80 (.result(CCF[9:8]));
  lpm_constant1 inst77 (.result(CCF[1:0]));
  lpm_bustri_BYT inst58 (.enabledt(ACP_CLUT_RD), .data(ACP_CLUT_RAM55_q_a), .tridata(FB_AD[23:16]));
  lpm_bustri_BYT inst57 (.enabledt(ACP_CLUT_RD), .data(ACP_CLUT_RAM54_q_a), .tridata(FB_AD[15:8]));
  lpm_bustri_BYT inst53 (.enabledt(ACP_CLUT_RD), .data(ACP_CLUT_RAM_q_a), .tridata(FB_AD[7:0]));
  lpm_bustri1 inst51 (.enabledt(ST_CLUT_RD), .data(ST_CLUT_RED_q_a), .tridata(FB_AD[26:24]));
  lpm_bustri1 inst56 (.enabledt(ST_CLUT_RD), .data(ST_CLUT_GREEN_q_a), .tridata(FB_AD[22:20]));
  lpm_bustri1 inst61 (.enabledt(ST_CLUT_RD), .data(ST_CLUT_BLUE_q_a), .tridata(FB_AD[18:16]));
  lpm_bustri3 inst66 (.enabledt(FALCON_CLUT_RDH), .data(FALCON_CLUT_RED_q_a), .tridata(FB_AD[31:26]));
  lpm_bustri3 inst70 (.enabledt(FALCON_CLUT_RDH), .data(FALCON_CLUT_GREEN_q_a), .tridata(FB_AD[23:18]));
  lpm_bustri3 inst74 (.enabledt(FALCON_CLUT_RDL), .data(FALCON_CLUT_BLUE_q_a), .tridata(FB_AD[23:18]));
  lpm_mux6 inst7 (
    .data7x(CCR), .data6x(CC24[23:0]), .data5x(CC16), .data4x(CCA), .data1x(inst46_q), .data0x(inst49_q),
    .clock(PIXEL_CLK), .sel(CCSEL), .result(inst7_result));  // open: data3x, data2x
  altddio_out2 inst5 (.datain_h(inst7_result), .datain_l(inst7_result), .outclock(PIXEL_CLK), .dataout({VR, VG, VB}));
endmodule
